# EAGLE design main_full_32 (EAGLE 9.4.2)
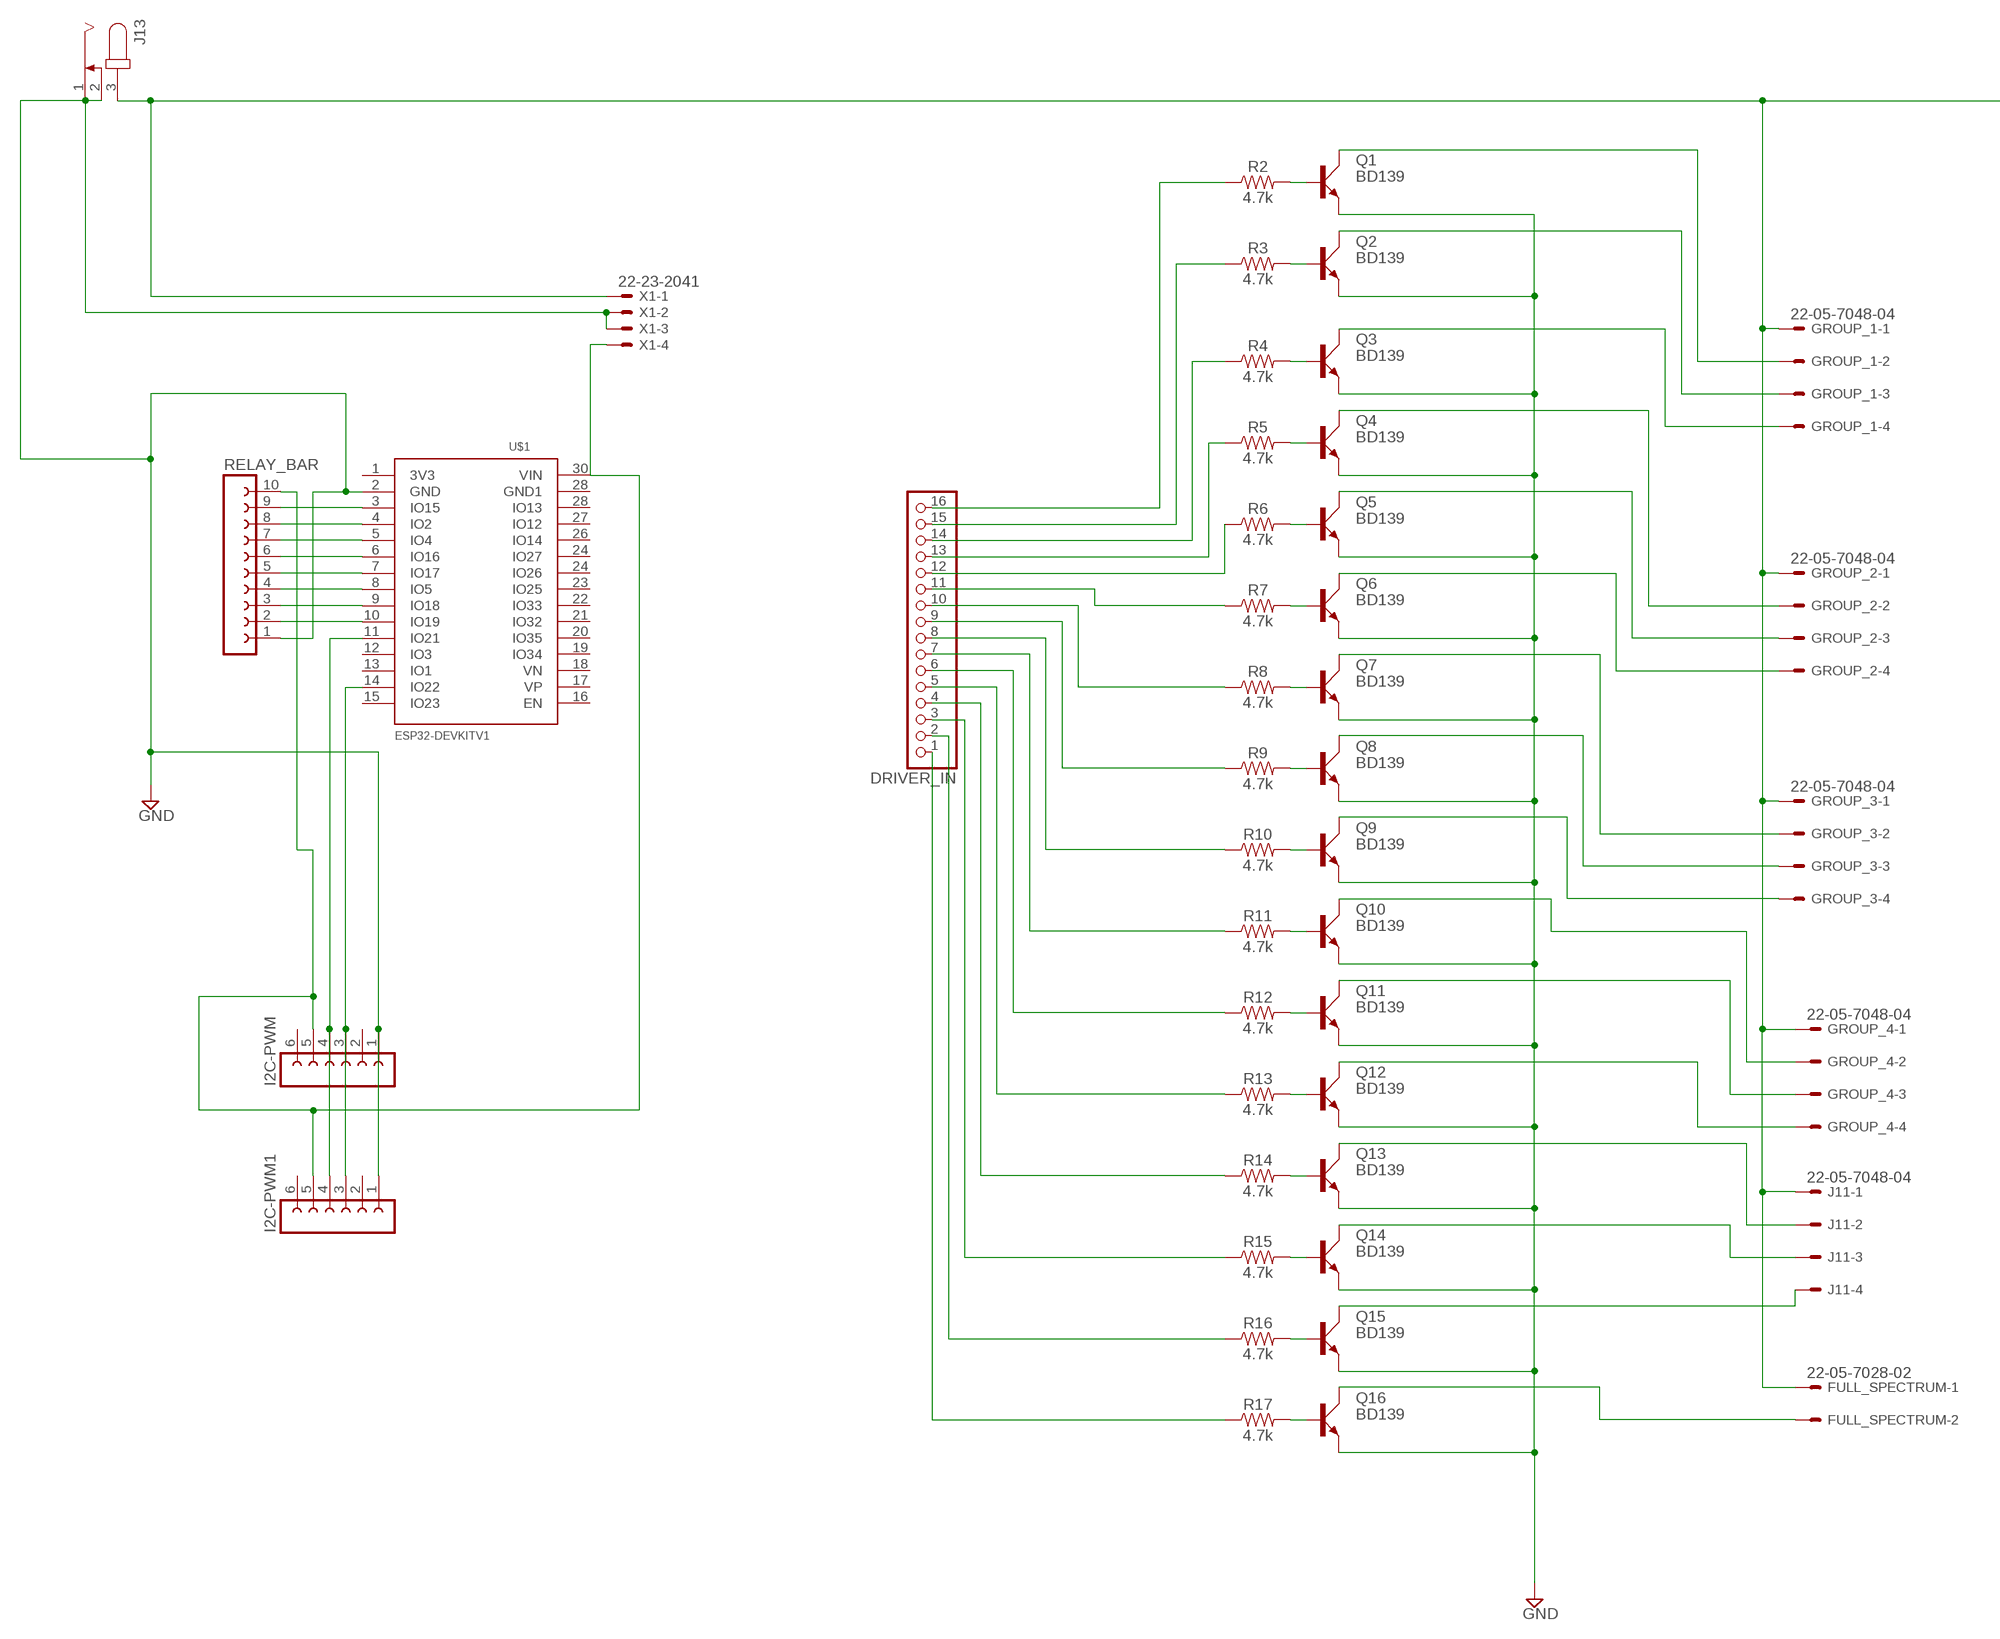
[diagram p0: schematic, sheet 1, part 1 of 2]
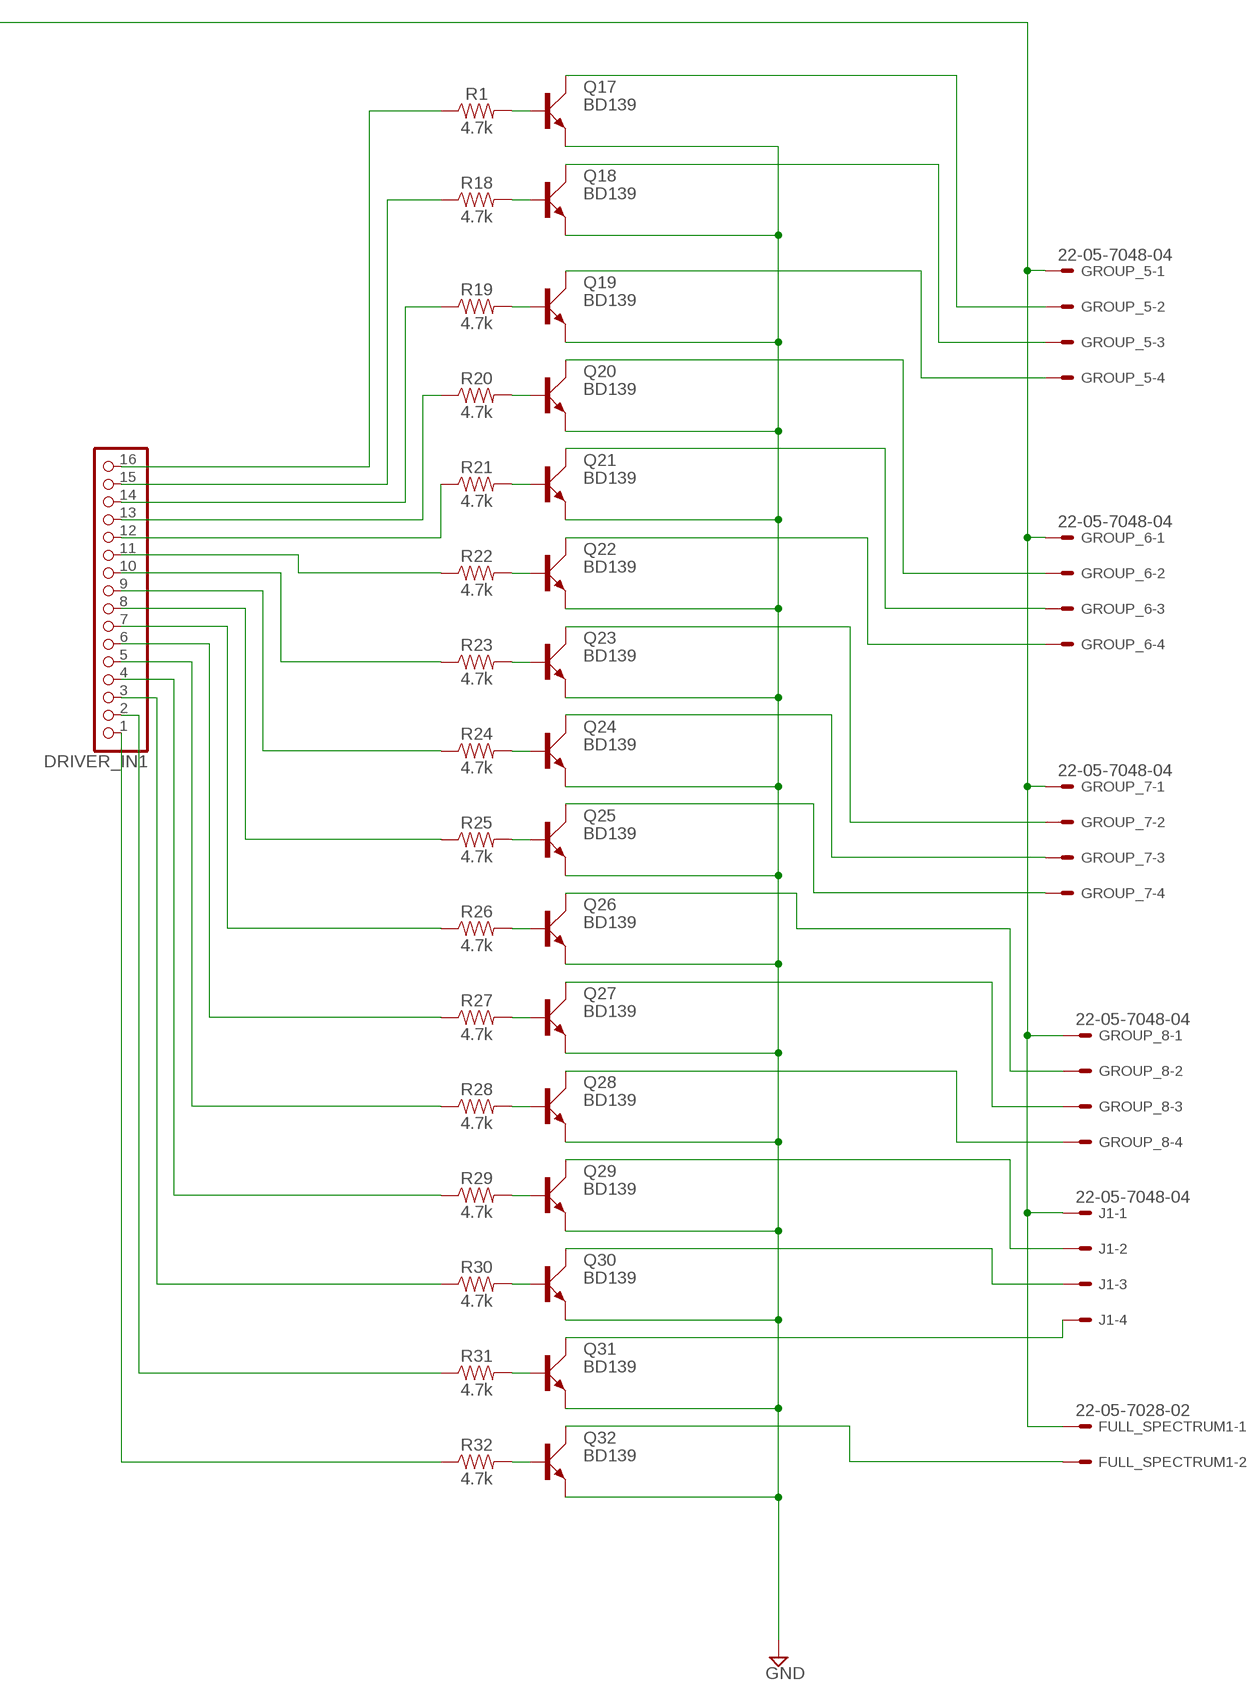
[diagram p1: schematic, sheet 1, part 2 of 2]

## Parts
DRIVER_IN  PINHD-1X16/90  [1X16/90]
DRIVER_IN1  PINHD-1X16/90  [1X16/90]
FULL_SPECTRUM  22-05-7028-02  [7395-02]
FULL_SPECTRUM1  22-05-7028-02  [7395-02]
GROUP_1  22-05-7048-04  [7395-04]
GROUP_2  22-05-7048-04  [7395-04]
GROUP_3  22-05-7048-04  [7395-04]
GROUP_4  22-05-7048-04  [7395-04]
GROUP_5  22-05-7048-04  [7395-04]
GROUP_6  22-05-7048-04  [7395-04]
GROUP_7  22-05-7048-04  [7395-04]
GROUP_8  22-05-7048-04  [7395-04]
I2C-PWM  FE06W  [FE06W]
I2C-PWM1  FE06W  [FE06W]
J1  22-05-7048-04  [7395-04]
J11  22-05-7048-04  [7395-04]
J13  JACK-PLUG0  [SPC4077]
Q1  BD139  [TO126AV]
Q2  BD139  [TO126AV]
Q3  BD139  [TO126AV]
Q4  BD139  [TO126AV]
Q5  BD139  [TO126AV]
Q6  BD139  [TO126AV]
Q7  BD139  [TO126AV]
Q8  BD139  [TO126AV]
Q9  BD139  [TO126AV]
Q10  BD139  [TO126AV]
Q11  BD139  [TO126AV]
Q12  BD139  [TO126AV]
Q13  BD139  [TO126AV]
Q14  BD139  [TO126AV]
Q15  BD139  [TO126AV]
Q16  BD139  [TO126AV]
Q17  BD139  [TO126AV]
Q18  BD139  [TO126AV]
Q19  BD139  [TO126AV]
Q20  BD139  [TO126AV]
Q21  BD139  [TO126AV]
Q22  BD139  [TO126AV]
Q23  BD139  [TO126AV]
Q24  BD139  [TO126AV]
Q25  BD139  [TO126AV]
Q26  BD139  [TO126AV]
Q27  BD139  [TO126AV]
Q28  BD139  [TO126AV]
Q29  BD139  [TO126AV]
Q30  BD139  [TO126AV]
Q31  BD139  [TO126AV]
Q32  BD139  [TO126AV]
R1  4.7k  4.7KOHM-0603-1/10W-1%  [0603]
R2  4.7k  4.7KOHM-0603-1/10W-1%  [0603]
R3  4.7k  4.7KOHM-0603-1/10W-1%  [0603]
R4  4.7k  4.7KOHM-0603-1/10W-1%  [0603]
R5  4.7k  4.7KOHM-0603-1/10W-1%  [0603]
R6  4.7k  4.7KOHM-0603-1/10W-1%  [0603]
R7  4.7k  4.7KOHM-0603-1/10W-1%  [0603]
R8  4.7k  4.7KOHM-0603-1/10W-1%  [0603]
R9  4.7k  4.7KOHM-0603-1/10W-1%  [0603]
R10  4.7k  4.7KOHM-0603-1/10W-1%  [0603]
R11  4.7k  4.7KOHM-0603-1/10W-1%  [0603]
R12  4.7k  4.7KOHM-0603-1/10W-1%  [0603]
R13  4.7k  4.7KOHM-0603-1/10W-1%  [0603]
R14  4.7k  4.7KOHM-0603-1/10W-1%  [0603]
R15  4.7k  4.7KOHM-0603-1/10W-1%  [0603]
R16  4.7k  4.7KOHM-0603-1/10W-1%  [0603]
R17  4.7k  4.7KOHM-0603-1/10W-1%  [0603]
R18  4.7k  4.7KOHM-0603-1/10W-1%  [0603]
R19  4.7k  4.7KOHM-0603-1/10W-1%  [0603]
R20  4.7k  4.7KOHM-0603-1/10W-1%  [0603]
R21  4.7k  4.7KOHM-0603-1/10W-1%  [0603]
R22  4.7k  4.7KOHM-0603-1/10W-1%  [0603]
R23  4.7k  4.7KOHM-0603-1/10W-1%  [0603]
R24  4.7k  4.7KOHM-0603-1/10W-1%  [0603]
R25  4.7k  4.7KOHM-0603-1/10W-1%  [0603]
R26  4.7k  4.7KOHM-0603-1/10W-1%  [0603]
R27  4.7k  4.7KOHM-0603-1/10W-1%  [0603]
R28  4.7k  4.7KOHM-0603-1/10W-1%  [0603]
R29  4.7k  4.7KOHM-0603-1/10W-1%  [0603]
R30  4.7k  4.7KOHM-0603-1/10W-1%  [0603]
R31  4.7k  4.7KOHM-0603-1/10W-1%  [0603]
R32  4.7k  4.7KOHM-0603-1/10W-1%  [0603]
RELAY_BAR  FE10W  [FE10W]
U$1  ESP32DEVKITV1  [ESP32-DEVKITV1]
X1  22-23-2041  [22-23-2041]

## Nets
GND: I2C-PWM1.1 I2C-PWM.1 J13.1 J13.2 Q1.E Q2.E Q3.E Q4.E Q5.E Q6.E Q7.E Q8.E Q9.E Q10.E Q11.E Q12.E Q13.E Q14.E Q15.E Q16.E Q17.E Q18.E Q19.E Q20.E Q21.E Q22.E Q23.E Q24.E Q25.E Q26.E Q27.E Q28.E Q29.E Q30.E Q31.E Q32.E RELAY_BAR.1 U$1.2(GND) X1.2 X1.3
N$1: FULL_SPECTRUM1.1 FULL_SPECTRUM.1 GROUP_1.1 GROUP_2.1 GROUP_3.1 GROUP_4.1 GROUP_5.1 GROUP_6.1 GROUP_7.1 GROUP_8.1 J1.1 J11.1 J13.3 X1.1
N$2: I2C-PWM1.5 I2C-PWM.5 RELAY_BAR.10 U$1.30(VIN) X1.4
N$3: Q1.B R2.2
N$4: Q2.B R3.2
N$5: Q3.B R4.2
N$6: Q4.B R5.2
N$7: Q5.B R6.2
N$8: Q6.B R7.2
N$9: Q7.B R8.2
N$10: Q8.B R9.2
N$11: Q9.B R10.2
N$12: Q10.B R11.2
N$13: Q11.B R12.2
N$14: Q12.B R13.2
N$15: Q13.B R14.2
N$16: Q14.B R15.2
N$17: Q15.B R16.2
N$18: Q16.B R17.2
N$19: DRIVER_IN.1 R17.1
N$20: DRIVER_IN.2 R16.1
N$21: DRIVER_IN.3 R15.1
N$22: DRIVER_IN.4 R14.1
N$23: DRIVER_IN.5 R13.1
N$24: DRIVER_IN.6 R12.1
N$25: DRIVER_IN.7 R11.1
N$26: DRIVER_IN.8 R10.1
N$27: DRIVER_IN.9 R9.1
N$28: DRIVER_IN.10 R8.1
N$29: DRIVER_IN.11 R7.1
N$30: DRIVER_IN.12 R6.1
N$31: DRIVER_IN.13 R5.1
N$32: DRIVER_IN.14 R4.1
N$33: DRIVER_IN.15 R3.1
N$34: DRIVER_IN.16 R2.1
N$35: RELAY_BAR.9 U$1.3(IO15)
N$36: RELAY_BAR.8 U$1.4(IO2)
N$37: RELAY_BAR.7 U$1.5(IO4)
N$38: RELAY_BAR.6 U$1.6(IO16)
N$39: RELAY_BAR.5 U$1.7(IO17)
N$40: RELAY_BAR.4 U$1.8(IO5)
N$41: RELAY_BAR.3 U$1.9(IO18)
N$42: RELAY_BAR.2 U$1.10(IO19)
N$44: Q17.B R1.2
N$45: Q18.B R18.2
N$46: Q19.B R19.2
N$47: Q20.B R20.2
N$48: Q21.B R21.2
N$49: I2C-PWM1.4 I2C-PWM.4 U$1.11(IO21)
N$50: I2C-PWM1.3 I2C-PWM.3 U$1.14(IO22)
N$51: GROUP_1.2 Q1.C
N$52: GROUP_1.3 Q2.C
N$53: GROUP_1.4 Q3.C
N$54: GROUP_2.2 Q4.C
N$55: GROUP_2.3 Q5.C
N$56: GROUP_2.4 Q6.C
N$57: GROUP_3.2 Q7.C
N$58: GROUP_3.3 Q8.C
N$59: GROUP_3.4 Q9.C
N$60: GROUP_4.2 Q10.C
N$61: GROUP_4.3 Q11.C
N$62: GROUP_4.4 Q12.C
N$63: Q22.B R22.2
N$64: J11.2 Q13.C
N$65: J11.3 Q14.C
N$66: J11.4 Q15.C
N$67: FULL_SPECTRUM.2 Q16.C
N$68: Q23.B R23.2
N$69: Q24.B R24.2
N$70: Q25.B R25.2
N$71: Q26.B R26.2
N$72: Q27.B R27.2
N$73: Q28.B R28.2
N$74: Q29.B R29.2
N$75: Q30.B R30.2
N$76: Q31.B R31.2
N$77: Q32.B R32.2
N$78: DRIVER_IN1.1 R32.1
N$79: DRIVER_IN1.2 R31.1
N$80: DRIVER_IN1.3 R30.1
N$81: DRIVER_IN1.4 R29.1
N$82: DRIVER_IN1.5 R28.1
N$83: DRIVER_IN1.6 R27.1
N$84: DRIVER_IN1.7 R26.1
N$85: DRIVER_IN1.8 R25.1
N$86: DRIVER_IN1.9 R24.1
N$87: DRIVER_IN1.10 R23.1
N$88: DRIVER_IN1.11 R22.1
N$89: DRIVER_IN1.12 R21.1
N$90: DRIVER_IN1.13 R20.1
N$91: DRIVER_IN1.14 R19.1
N$92: DRIVER_IN1.15 R18.1
N$93: DRIVER_IN1.16 R1.1
N$94: GROUP_5.2 Q17.C
N$95: GROUP_5.3 Q18.C
N$96: GROUP_5.4 Q19.C
N$97: GROUP_6.2 Q20.C
N$98: GROUP_6.3 Q21.C
N$99: GROUP_6.4 Q22.C
N$100: GROUP_7.2 Q23.C
N$101: GROUP_7.3 Q24.C
N$102: GROUP_7.4 Q25.C
N$103: GROUP_8.2 Q26.C
N$104: GROUP_8.3 Q27.C
N$105: GROUP_8.4 Q28.C
N$106: J1.2 Q29.C
N$107: J1.3 Q30.C
N$108: J1.4 Q31.C
N$109: FULL_SPECTRUM1.2 Q32.C
Unconnected: I2C-PWM1.2 I2C-PWM1.6 I2C-PWM.2 I2C-PWM.6 U$1.1(3V3) U$1.12(IO3) U$1.13(IO1) U$1.15(IO23) U$1.16(EN) U$1.17(VP) U$1.18(VN) U$1.19(IO34) U$1.20(IO35) U$1.21(IO32) U$1.22(IO33) U$1.23(IO25) U$1.24(IO26) U$1.24(IO27) U$1.26(IO14) U$1.27(IO12) U$1.28(GND1) U$1.28(IO13)

## Library data of the parts
DRIVER_IN DRIVER_IN1 = pinhead:PINHD-1X16: PIN HEADER
FULL_SPECTRUM FULL_SPECTRUM1 = con-molex:22-?-02: CONNECTOR wire to board 2.54 mm (.1 inch) pitch header; MF: MOLEX; OC_FARNELL: 9731601; OC_NEWARK: unknown
GROUP_1-GROUP_8 J1 J11 = con-molex:22-?-04: CONNECTOR wire to board 2.54 mm (.1 inch) pitch header; MF: MOLEX; OC_FARNELL: unknown; OC_NEWARK: unknown
I2C-PWM I2C-PWM1 = con-lsta:FE06W: FEMALE HEADER; OC_FARNELL: unknown; OC_NEWARK: unknown
J13 = con-jack:JACK-PLUG: DC POWER JACK Power Jack, DC, Right Angle, Through Hole, Rated 5A at 16VDC, PC Terminals Distributor: Farnell (www.Farnell.de) Drawing: 84N1161.pdf / 84N1162.pdf Manufacturer: SPC Technology (www.spctechnology.com) Type: SPC4077 / SPC 4078; OC_FARNELL: unknown; OC_NEWARK: unknown
Q1-Q32 = transistor-power:BD139: NPN TRANSISTOR
R1-R32 = SparkFun-Resistors:4.7KOHM: 4.7kΩ resistor A resistor is a passive two-terminal electrical component that implements electrical resistance as a circuit element. Resistors act to reduce current flow, and, at the same time, act to lower voltage levels within circuits. - Wikipedia; PROD_ID: RES-07857
RELAY_BAR = con-lsta:FE10W: FEMALE HEADER; OC_FARNELL: unknown; OC_NEWARK: unknown
U$1 = ESP32-DEVKITV1:ESP32DEVKITV1
X1 = con-molex:22-23-2041: .100" (2.54mm) Center Header - 4 Pin; MF: MOLEX; MPN: 22-23-2041; OC_FARNELL: 1462920; OC_NEWARK: 38C0355

## Board
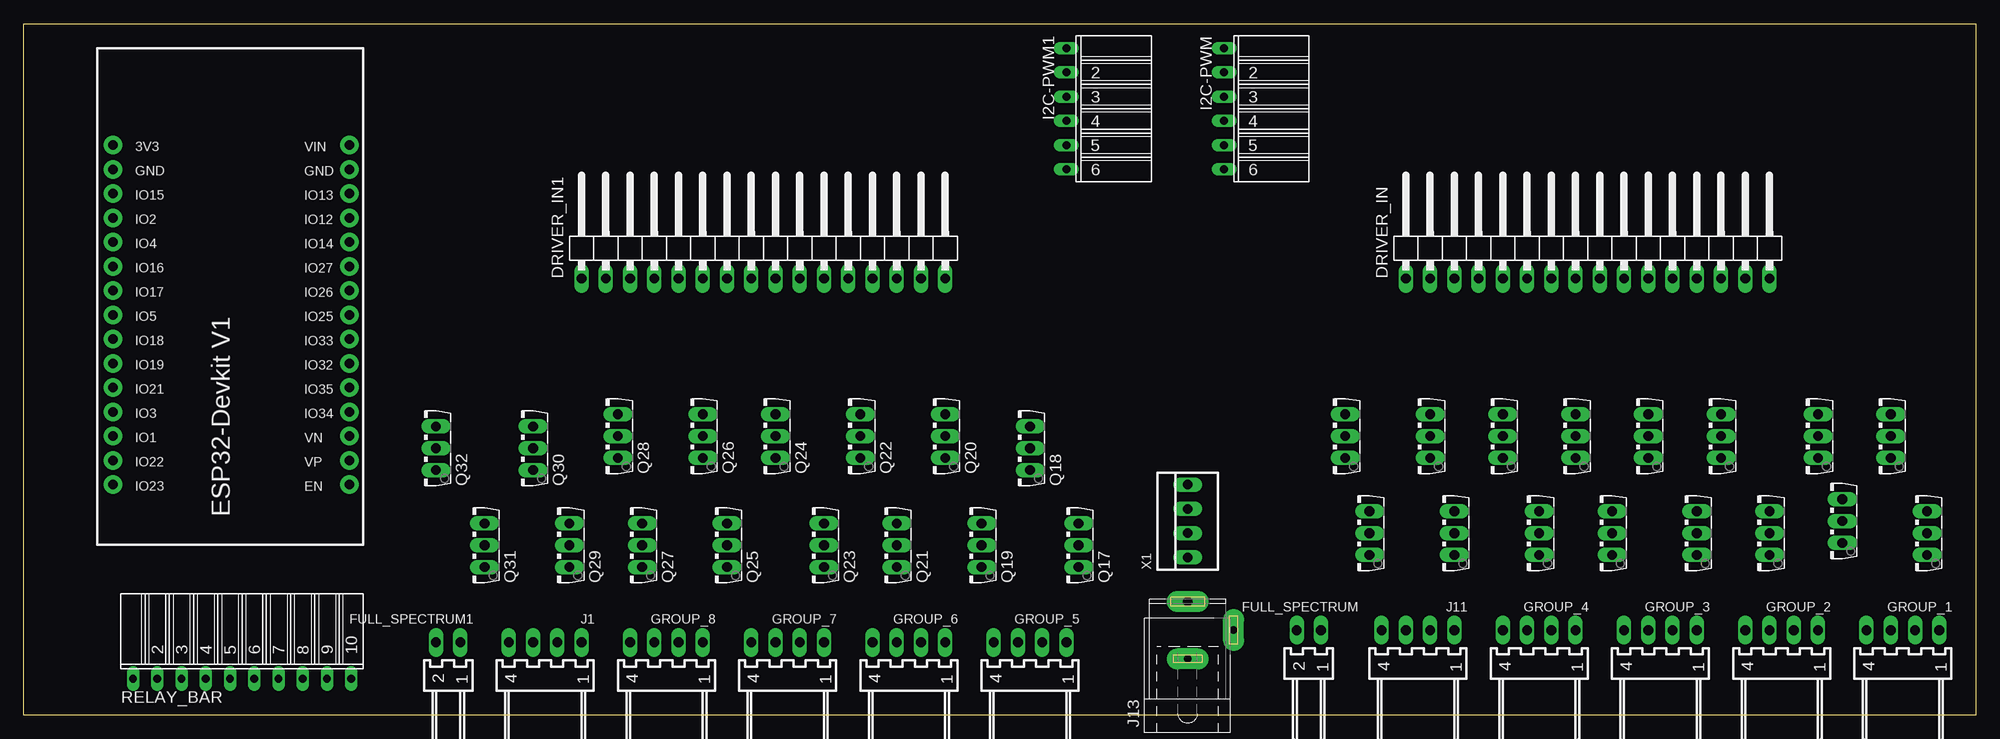
[diagram p2: board, top side]
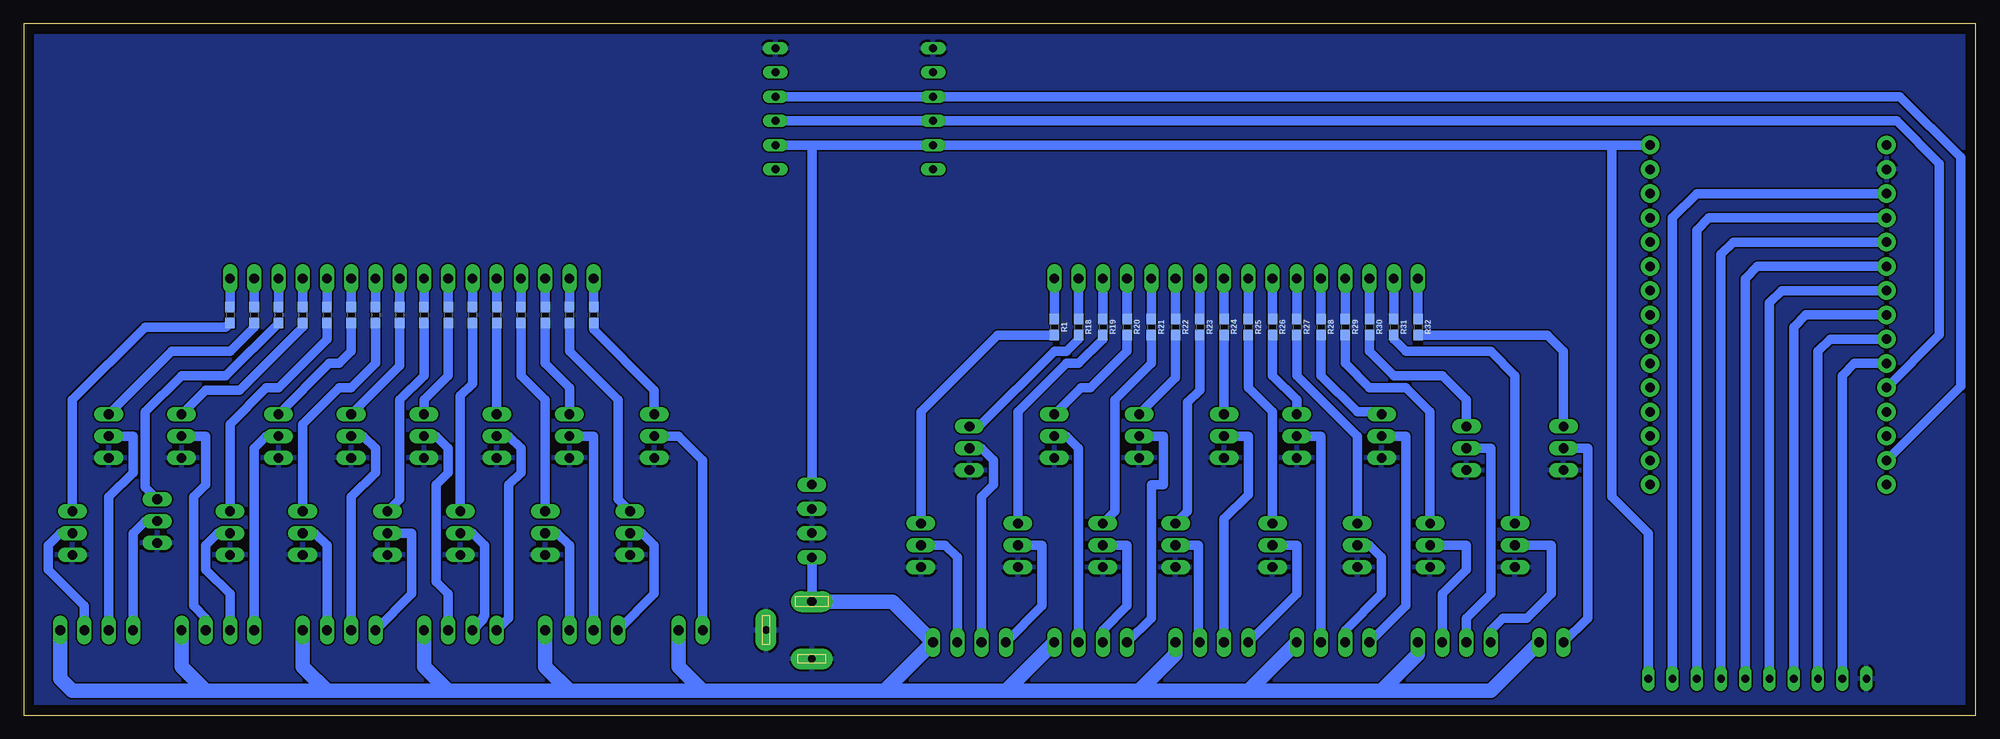
[diagram p3: board, bottom side, seen from below]

Size 204.47 x 72.39 mm. Coordinates in mm from the lower left corner, seen from the top.
Outline: 0,72.39 204.47,72.39 204.47,0 0,0 0,72.39
Copper layers (1*16): Top 0.035mm / dielectric 1.5mm / Bottom 0.035mm
Design rules "default": minimum track width 6mil, minimum drill 0.35mm, track to track 6mil, track to pad 6mil, pad to pad 6mil, via to via 6mil, smd to smd 6mil, copper to edge 40mil, drill to drill 6mil, minimum pad ring 10mil, minimum via ring 8mil, stop-mask expansion 4mil, vias tented up to drill 0mil, thermal gap 10mil

### Footprints (pad centres in the part's own frame; a part is rotated, then mirrored left to right if it is on the bottom)
1X16/90 = drill 1.016 long: 1 -19.05,-3.81; 2 -16.51,-3.81; 3 -13.97,-3.81; 4 -11.43,-3.81; 5 -8.89,-3.81; 6 -6.35,-3.81; 7 -3.81,-3.81; 8 -1.27,-3.81; 9 1.27,-3.81; 10 3.81,-3.81; 11 6.35,-3.81; 12 8.89,-3.81; 13 11.43,-3.81; 14 13.97,-3.81; 15 16.51,-3.81; 16 19.05,-3.81
7395-02 = drill 1.016 long: 1 1.27,0; 2 -1.27,0
7395-04 = drill 1.016 long: 1 3.81,0; 2 1.27,0; 3 -1.27,0; 4 -3.81,0
FE06W = drill 0.813 long: 1 -6.35,0; 2 -3.81,0; 3 -1.27,0; 4 1.27,0; 5 3.81,0; 6 6.35,0
SPC4077 = drill 0.8 pad 2.184 long: 1 -3,0; 2 0,-4.8 | drill 1 pad 2.184 long: 3 3,0
TO126AV = drill 1.016 long: B 2.286,-1.27; C 0,-1.27; E -2.286,-1.27
0603 = smd 1.1 x 1: 1 -0.85,0; 2 0.85,0
FE10W = drill 0.813 long: 1 -11.43,0; 2 -8.89,0; 3 -6.35,0; 4 -3.81,0; 5 -1.27,0; 6 1.27,0; 7 3.81,0; 8 6.35,0; 9 8.89,0; 10 11.43,0
ESP32-DEVKITV1 = drill 1 pad 1.93: 1 -22.87,-13.54; 2 -20.33,-13.54; 3 -17.79,-13.54; 4 -15.25,-13.54; 5 -12.71,-13.54; 6 -10.17,-13.54; 7 -7.63,-13.54; 8 -5.09,-13.54; 9 -2.55,-13.54; 10 -0.01,-13.54; 11 2.53,-13.54; 12 5.07,-13.54; 13 7.61,-13.54; 14 10.15,-13.54; 15 12.69,-13.54; 16 12.69,11.23; 17 10.15,11.23; 18 7.61,11.23; 19 5.07,11.23; 20 2.53,11.23; 21 -0.01,11.23; 22 -2.55,11.23; 23 -5.09,11.23; 24 -7.63,11.23; 25 -10.17,11.23; 26 -12.71,11.23; 27 -15.25,11.23; 28 -17.79,11.23; 29 -20.33,11.23; 30 -22.87,11.23
22-23-2041 = drill 1 long: 1 -3.81,0; 2 -1.27,0; 3 1.27,0; 4 3.81,0

### Placement (x,y rotation side)
DRIVER_IN  163.83,49.53 0 top
DRIVER_IN1  77.47,49.53 0 top
FULL_SPECTRUM  134.62,8.89 0 top
FULL_SPECTRUM1  44.45,7.62 0 top
GROUP_1  196.85,8.89 0 top
GROUP_2  184.15,8.89 0 top
GROUP_3  171.45,8.89 0 top
GROUP_4  158.75,8.89 0 top
GROUP_5  105.41,7.62 0 top
GROUP_6  92.71,7.62 0 top
GROUP_7  80.01,7.62 0 top
GROUP_8  67.31,7.62 0 top
I2C-PWM  125.73,63.5 270 top
I2C-PWM1  109.22,63.5 270 top
J1  54.61,7.62 0 top
J11  146.05,8.89 0 top
J13  121.92,8.89 90 top
Q1  198.12,19.05 90 top
Q2  194.31,29.21 90 top
Q3  189.23,20.32 90 top
Q4  186.69,29.21 90 top
Q5  181.61,19.05 90 top
Q6  176.53,29.21 90 top
Q7  173.99,19.05 90 top
Q8  168.91,29.21 90 top
Q9  165.1,19.05 90 top
Q10  161.29,29.21 90 top
Q11  157.48,19.05 90 top
Q12  153.67,29.21 90 top
Q13  148.59,19.05 90 top
Q14  146.05,29.21 90 top
Q15  139.7,19.05 90 top
Q16  137.16,29.21 90 top
Q17  109.22,17.78 90 top
Q18  104.14,27.94 90 top
Q19  99.06,17.78 90 top
Q20  95.25,29.21 90 top
Q21  90.17,17.78 90 top
Q22  86.36,29.21 90 top
Q23  82.55,17.78 90 top
Q24  77.47,29.21 90 top
Q25  72.39,17.78 90 top
Q26  69.85,29.21 90 top
Q27  63.5,17.78 90 top
Q28  60.96,29.21 90 top
Q29  55.88,17.78 90 top
Q30  52.07,27.94 90 top
Q31  46.99,17.78 90 top
Q32  41.91,27.94 90 top
R1  96.52,40.64 270 bottom
R2  182.88,41.91 270 bottom
R3  180.34,41.91 270 bottom
R4  177.8,41.91 270 bottom
R5  175.26,41.91 270 bottom
R6  172.72,41.91 270 bottom
R7  170.18,41.91 270 bottom
R8  167.64,41.91 270 bottom
R9  165.1,41.91 270 bottom
R10  162.56,41.91 270 bottom
R11  160.02,41.91 270 bottom
R12  157.48,41.91 270 bottom
R13  154.94,41.91 270 bottom
R14  152.4,41.91 270 bottom
R15  149.86,41.91 270 bottom
R16  147.32,41.91 270 bottom
R17  144.78,41.91 270 bottom
R18  93.98,40.64 270 bottom
R19  91.44,40.64 270 bottom
R20  88.9,40.64 270 bottom
R21  86.36,40.64 270 bottom
R22  83.82,40.64 270 bottom
R23  81.28,40.64 270 bottom
R24  78.74,40.64 270 bottom
R25  76.2,40.64 270 bottom
R26  73.66,40.64 270 bottom
R27  71.12,40.64 270 bottom
R28  68.58,40.64 270 bottom
R29  66.04,40.64 270 bottom
R30  63.5,40.64 270 bottom
R31  60.96,40.64 270 bottom
R32  58.42,40.64 270 bottom
RELAY_BAR  22.86,3.81 0 top
U$1  22.86,36.83 270 top
X1  121.92,20.32 90 top

### Tracks (layer width: path | path; a pad name or v marks a point on that pad's centre or on a via)
GND
  pour Bottom: 0,72.39 204.47,72.39 204.47,0 0,0
N$1
  Bottom 1.016: X1.1 J13.3
  Bottom 1.524: 133.35,2.54 147.32,2.54 | 147.32,2.54 160.02,2.54 | 160.02,2.54 172.72,2.54 | 172.72,2.54 185.42,2.54 | 185.42,2.54 199.39,2.54 200.66,3.81 GROUP_1.1 | 185.42,2.54 187.96,5.08 GROUP_2.1 | 172.72,2.54 175.26,5.08 GROUP_3.1 | 160.02,2.54 162.56,5.08 GROUP_4.1 | 147.32,2.54 149.86,5.08 J11.1 | 133.35,2.54 135.89,5.08 FULL_SPECTRUM.1 | 133.35,2.54 114.3,2.54 | 114.3,2.54 101.6,2.54 | 101.6,2.54 87.63,2.54 | 87.63,2.54 76.2,2.54 | 76.2,2.54 62.23,2.54 | 62.23,2.54 50.8,2.54 FULL_SPECTRUM1.1 | 62.23,2.54 58.42,6.35 J1.1 | 76.2,2.54 GROUP_8.1 | 87.63,2.54 83.82,6.35 GROUP_7.1 | 101.6,2.54 GROUP_6.1 | 114.3,2.54 GROUP_5.1 113.49,11.89 J13.3
N$2
  Bottom 1.016: I2C-PWM.5 121.92,59.69 | 121.92,59.69 I2C-PWM1.5 38.1,59.69 | X1.4 121.92,59.69 | U$1.30 38.1,59.69 | RELAY_BAR.10 34.29,19.05 38.1,22.86 38.1,59.69
N$3
  Bottom 1.016: Q1.B 199.39,33.02 191.77,40.64 183.3,40.64 R2.2
N$4
  Bottom 1.016: Q2.B 188.98,38.1 182.88,38.1 180.34,40.64 R3.2
N$5
  Bottom 1.016: Q3.B 191.77,23.88 191.77,31.75 187.96,35.56 183.3,35.56 R4.2
N$6
  Bottom 1.016: Q4.B 185.42,34.04 181.86,34.04 175.26,40.64 R5.2
N$7
  Bottom 1.016: Q5.B 182.88,30.48 179.07,34.29 177.8,34.29 172.72,39.37 R6.2
N$8
  Bottom 1.016: Q6.B 172.47,36.83 171.45,36.83 170.18,38.1 R7.2
N$9
  Bottom 1.016: R8.2 167.64,36.83 170.18,34.29 171.45,34.29 175.26,30.48 Q7.B
N$10
  Bottom 1.016: Q8.B 165.1,36.58 R9.2
N$11
  Bottom 1.016: R10.2 162.56,35.56 165.1,33.02 165.1,22.61 Q9.B
N$12
  Bottom 1.016: Q10.B 162.56,33.02 160.02,35.56 R11.2
N$13
  Bottom 1.016: R12.2 157.48,34.71 158.75,33.44 Q11.B
N$14
  Bottom 1.016: Q12.B 154.94,39.37 154.94,40.64 R13.2
N$15
  Bottom 1.016: Q13.B 149.86,33.02 152.4,35.56 R14.2
N$16
  Bottom 1.016: Q14.B 147.32,34.29 149.86,36.83 R15.2
N$17
  Bottom 1.016: Q15.B 142.24,22.61 142.24,33.02 147.32,38.1 R16.2
N$18
  Bottom 1.016: Q16.B 138.43,34.04 144.78,40.39 R17.2
N$19
  Bottom 1.016: R17.1 DRIVER_IN.1
N$20
  Bottom 1.016: R16.1 DRIVER_IN.2
N$21
  Bottom 1.016: R15.1 DRIVER_IN.3
N$22
  Bottom 1.016: R14.1 DRIVER_IN.4
N$23
  Bottom 1.016: R13.1 DRIVER_IN.5
N$24
  Bottom 1.016: R12.1 DRIVER_IN.6
N$25
  Bottom 1.016: R11.1 DRIVER_IN.7
N$26
  Bottom 1.016: R10.1 DRIVER_IN.8
N$27
  Bottom 1.016: R9.1 DRIVER_IN.9
N$28
  Bottom 1.016: DRIVER_IN.10 R8.1
N$29
  Bottom 1.016: DRIVER_IN.11 R7.1
N$30
  Bottom 1.016: DRIVER_IN.12 R6.1
N$31
  Bottom 1.016: DRIVER_IN.13 R5.1
N$32
  Bottom 1.016: DRIVER_IN.14 R4.1
N$33
  Bottom 1.016: DRIVER_IN.15 R3.1
N$34
  Bottom 1.016: DRIVER_IN.16 R2.1
N$35
  Bottom 1.016: U$1.3 29.2,54.62 31.75,52.07 RELAY_BAR.9
N$36
  Bottom 1.016: U$1.4 27.93,52.08 29.21,50.8 RELAY_BAR.8
N$37
  Bottom 1.016: U$1.5 25.39,49.54 26.67,48.26 RELAY_BAR.7
N$38
  Bottom 1.016: U$1.6 22.85,47 24.13,45.72 RELAY_BAR.6
N$39
  Bottom 1.016: U$1.7 20.31,44.46 20.32,44.45 21.59,43.18 RELAY_BAR.5
N$40
  Bottom 1.016: U$1.8 16.5,41.92 16.51,41.91 17.78,41.91 19.05,40.64 RELAY_BAR.4
N$41
  Bottom 1.016: U$1.9 15.24,39.37 16.51,38.1 RELAY_BAR.3
N$42
  Bottom 1.016: U$1.10 12.7,36.83 13.97,35.56 RELAY_BAR.2
N$44
  Bottom 1.016: Q17.B 110.49,31.75 102.45,39.79 R1.2
N$45
  Bottom 1.016: Q18.B 104.39,30.23 96.52,38.1 95.25,38.1 93.98,39.37 R18.2
N$46
  Bottom 1.016: Q19.B 100.33,31.75 95.25,36.83 93.98,36.83 91.44,39.37 R19.2
N$47
  Bottom 1.016: Q20.B 93.73,34.29 92.71,34.29 88.9,38.1 88.9,39.37 R20.2
N$48
  Bottom 1.016: Q21.B 90.17,21.34 90.17,33.02 86.36,36.83 R21.2
N$49
  Bottom 1.016: I2C-PWM.4 I2C-PWM1.4 8.28,62.23 3.81,57.76 3.81,39.81 U$1.11
N$50
  Bottom 1.016: I2C-PWM.3 I2C-PWM1.3 7.93,64.77 1.57,58.42 1.57,34.42 U$1.14
N$51
  Bottom 1.016: GROUP_1.2 198.12,11.43 201.93,15.24 201.93,17.78 200.66,19.05 Q1.C
N$52
  Bottom 1.016: Q2.C 193.04,29.21 193.04,25.4 195.58,22.86 GROUP_1.3
N$53
  Bottom 1.016: Q3.C 191.77,20.32 193.04,19.05 GROUP_1.4
N$54
  Bottom 1.016: Q4.C 185.42,29.21 185.42,24.13 186.69,22.86 186.69,11.43 185.42,10.16 GROUP_2.2
N$55
  Bottom 1.016: Q5.C 184.15,19.05 185.42,17.78 185.42,15.24 182.88,12.7 GROUP_2.3
N$56
  Bottom 1.016: Q6.C 179.07,29.21 180.34,27.94 GROUP_2.4
N$57
  Bottom 1.016: GROUP_3.2 172.72,17.78 173.99,19.05 Q7.C
N$58
  Bottom 1.016: GROUP_3.3 170.18,22.86 167.64,25.4 167.64,27.94 168.91,29.21 Q8.C
N$59
  Bottom 1.016: Q9.C 163.83,19.05 163.83,12.7 GROUP_3.4
N$60
  Bottom 1.016: GROUP_4.2 160.02,12.7 161.29,13.97 161.29,24.13 160.02,25.4 160.02,27.94 161.29,29.21 Q10.C
N$61
  Bottom 1.016: GROUP_4.3 156.36,10.01 156.36,10.24 156.21,10.39 156.21,17.78 157.48,19.05 Q11.C
N$62
  Bottom 1.016: Q12.C 153.67,29.21 152.4,27.94 152.4,25.4 153.67,24.13 153.67,10.16 GROUP_4.4
N$63
  Bottom 1.016: Q22.B 83.82,35.31 R22.2
N$64
  Bottom 1.016: Q13.C 148.59,19.05 147.32,17.78 J11.2
N$65
  Bottom 1.016: Q14.C 144.78,29.21 J11.3
N$66
  Bottom 1.016: Q15.C 139.7,19.05 138.43,17.78 138.43,12.7 J11.4
N$67
  Bottom 1.016: Q16.C 135.89,29.21 133.35,26.67 FULL_SPECTRUM.2
N$68
  Bottom 1.016: R23.2 81.28,34.04 82.55,32.77 82.55,21.34 Q23.B
N$69
  Bottom 1.016: R24.2 Q24.B
N$70
  Bottom 1.016: Q25.B 73.66,31.75 76.2,34.29 R25.2
N$71
  Bottom 1.016: Q26.B 71.12,33.02 73.66,35.56 R26.2
N$72
  Bottom 1.016: Q27.B 64.77,29.21 71.12,35.56 R27.2
N$73
  Bottom 1.016: Q28.B 62.48,31.75 64.77,31.75 68.58,35.56 R28.2
N$74
  Bottom 1.016: Q29.B 57.15,31.75 59.69,34.29 63.5,34.29 66.04,36.83 R29.2
N$75
  Bottom 1.016: Q30.B 53.34,33.02 55.88,35.56 60.96,35.56 63.5,38.1 R30.2
N$76
  Bottom 1.016: Q31.B 48.26,35.56 50.8,38.1 59.69,38.1 60.96,39.37 R31.2
N$77
  Bottom 1.016: Q32.B 43.18,38.1 44.87,39.79 R32.2
N$78
  Bottom 1.016: R32.1 DRIVER_IN1.1
N$79
  Bottom 1.016: R31.1 DRIVER_IN1.2
N$80
  Bottom 1.016: DRIVER_IN1.3 R30.1
N$81
  Bottom 1.016: DRIVER_IN1.4 R29.1
N$82
  Bottom 1.016: DRIVER_IN1.5 R28.1
N$83
  Bottom 1.016: DRIVER_IN1.6 R27.1
N$84
  Bottom 1.016: DRIVER_IN1.7 R26.1
N$85
  Bottom 1.016: DRIVER_IN1.8 R25.1
N$86
  Bottom 1.016: DRIVER_IN1.9 R24.1
N$87
  Bottom 1.016: DRIVER_IN1.10 R23.1
N$88
  Bottom 1.016: DRIVER_IN1.11 R22.1
N$89
  Bottom 1.016: DRIVER_IN1.12 R21.1
N$90
  Bottom 1.016: DRIVER_IN1.13 R20.1
N$91
  Bottom 1.016: DRIVER_IN1.14 R19.1
N$92
  Bottom 1.016: DRIVER_IN1.15 R18.1
N$93
  Bottom 1.016: DRIVER_IN1.16 R1.1
N$94
  Bottom 1.016: Q17.C 107.95,17.78 106.68,16.51 GROUP_5.2
N$95
  Bottom 1.016: Q18.C 104.14,27.94 102.87,26.67 102.87,24.13 104.14,22.86 GROUP_5.3
N$96
  Bottom 1.016: GROUP_5.4 97.79,11.43 97.79,17.78 Q19.C
N$97
  Bottom 1.016: Q20.C 95.25,29.21 93.98,27.94 GROUP_6.2
N$98
  Bottom 1.016: Q21.C 88.9,17.78 88.9,11.43 91.44,8.89 GROUP_6.3
N$99
  Bottom 1.016: Q22.C 85.09,29.21 85.09,24.13 86.36,24.13 86.36,10.16 GROUP_6.4
N$100
  Bottom 1.016: Q23.C 81.43,17.78 81.43,7.77 GROUP_7.2
N$101
  Bottom 1.016: Q24.C 76.2,29.21 76.2,23.09 78.74,20.55 GROUP_7.3
N$102
  Bottom 1.016: Q25.C 71.12,17.78 71.12,12.7 GROUP_7.4
N$103
  Bottom 1.016: Q26.C 68.58,29.21 GROUP_8.2
N$104
  Bottom 1.016: GROUP_8.3 66.04,8.89 62.23,12.7 62.23,16.51 63.5,17.78 Q27.C
N$105
  Bottom 1.016: Q28.C 59.69,29.21 59.69,11.43 GROUP_8.4
N$106
  Bottom 1.016: Q29.C 53.34,17.78 53.34,15.24 55.88,12.7 J1.2
N$107
  Bottom 1.016: Q30.C 50.8,27.94 50.8,12.7 53.34,10.16 J1.3
N$108
  Bottom 1.016: Q31.C 44.45,17.78 44.45,12.7 46.99,10.16 49.53,10.16 50.8,8.89 J1.4
N$109
  Bottom 1.016: Q32.C 40.64,27.94 40.64,10.16 FULL_SPECTRUM1.2